# Altium project Driver_BaseSTM32G4.PrjPcb
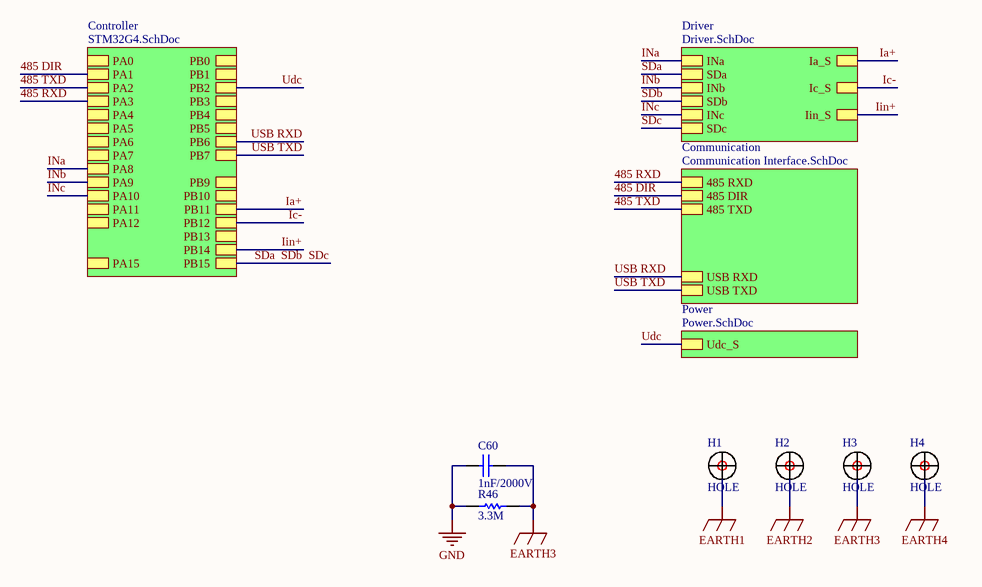
[diagram p0: Main.SchDoc]
5 sheets, 174 parts. Net scope: hierarchical (ports join the sheet entries above them; power ports are global).
Board file: Driver.PcbDoc
Sheets:
  Main.SchDoc
    Controller = STM32G4.SchDoc
    Power = Power.SchDoc
    Driver = Driver.SchDoc
    Communication = Communication Interface.SchDoc

## Sheet Main.SchDoc
size A4

### Parts
C60  1nF/2000V  [C1206]
H1  HOLE  [定位孔 Φ3 1]
H2  HOLE  [定位孔 Φ3 1]
H3  HOLE  [定位孔 Φ3 1]
H4  HOLE  [定位孔 Φ3 1]
R46  3.3M  [R1206]

### Sub-sheets
Communication = Communication Interface.SchDoc: 485 RXD, 485 DIR, 485 TXD, USB RXD, USB TXD
Controller = STM32G4.SchDoc: PA1, PA2, PA3, PA4, PA5, PA6, PA7, PA8, PA9, PA10, PA11, PA12, PA15, PB1, PB2, PB3, PB4, PB5, PB6, PB7, PB9, PB10, PB11, PB12, PB13, PB14, PB15, PA0, PB0
Driver = Driver.SchDoc: INa, SDa, Ia_S, Ic_S, INb, SDb, INc, SDc, Iin_S
Power = Power.SchDoc: Udc_S

### Nets
EARTH1: H1.1
EARTH2: H2.1
EARTH3: C60.2 H3.1 R46.1
EARTH4: H4.1
GND: C60.1 R46.2
485 DIR: sheet Controller/PA1, sheet Communication/485 DIR
485 RXD: sheet Controller/PA3, sheet Communication/485 RXD
485 TXD: sheet Controller/PA2, sheet Communication/485 TXD
Ia+: sheet Controller/PB11, sheet Driver/Ia_S
Ic-: sheet Controller/PB12, sheet Driver/Ic_S
Iin+: sheet Controller/PB14, sheet Driver/Iin_S
INa: sheet Controller/PA8, sheet Driver/INa
INb: sheet Controller/PA9, sheet Driver/INb
INc: sheet Controller/PA10, sheet Driver/INc
SDa: sheet Controller/PB15, sheet Driver/SDa, sheet Driver/SDb, sheet Driver/SDc  [also labelled SDb, SDc]
Udc: sheet Controller/PB2, sheet Power/Udc_S
USB RXD: sheet Controller/PB6, sheet Communication/USB RXD
USB TXD: sheet Controller/PB7, sheet Communication/USB TXD

### Library data of the parts
C60 = Cap
R46 = RES

## Sheet STM32G4.SchDoc
size A4
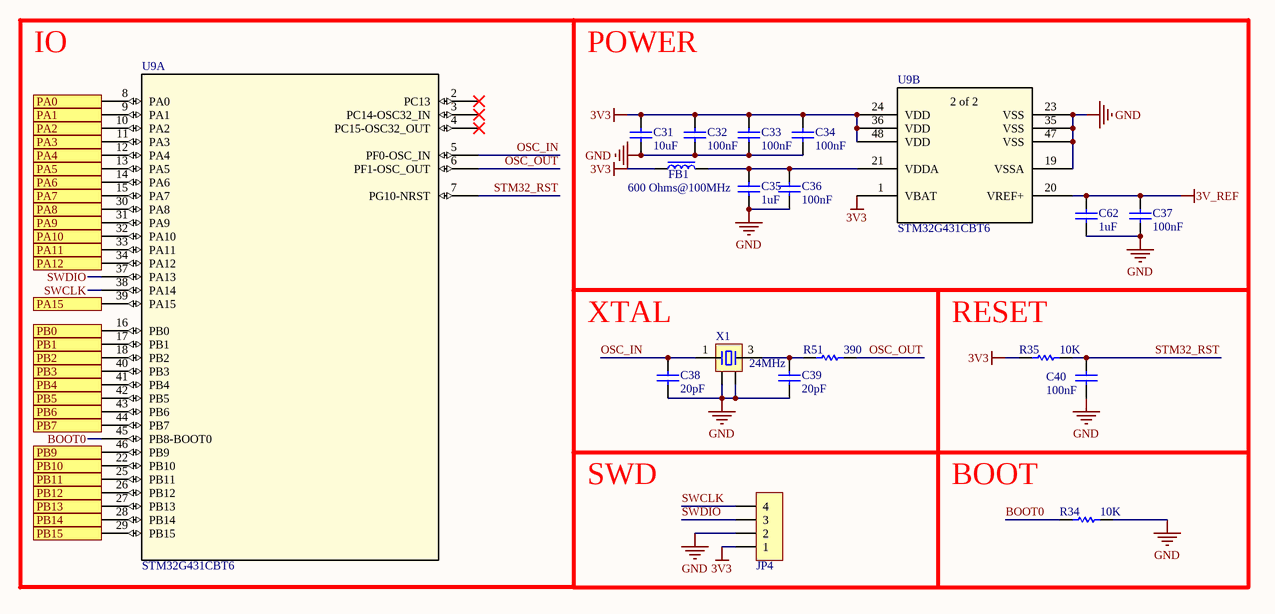
[diagram p1: STM32G4.SchDoc]

### Parts
C31  10uF  [C0805]
C32  100nF  [C0402]
C33  100nF  [C0402]
C34  100nF  [C0402]
C35  1uF  [C0603]
C36  100nF  [C0402]
C37  100nF  [C0402]
C38  20pF  [C0402]
C39  20pF  [C0402]
C40  100nF  [C0402]
C62  1uF  [C0603]
FB1  600 Ohms@100MHz  [FB 0402]
JP4  HDR-1X4  [XH2.54-4P_H]  (value not drawn)
R34  10K  [R0402]
R35  10K  [R0402]
R51  390  [R0402]
U9  STM32G431CBT6  [LQFP48 7X7_L]  (parts A,B of 2)
X1  24MHz  [XTAL-3225]

### Ports
PA0, PA1, PA2, PA3, PA4, PA5, PA6, PA7, PA8, PA9, PA10, PA11, PA12, PA15, PB0, PB1, PB2, PB3, PB4, PB5, PB6, PB7, PB9, PB10, PB11, PB12, PB13, PB14, PB15

### Nets
3V3: C31.2 C32.2 C33.2 C34.2 FB1.1 JP4.1 R35.1 U9.1(VBAT) U9.24(VDD) U9.36(VDD) U9.48(VDD)
3V_REF: C37.1 C62.1 U9.20(VREF+)
GND: C31.1 C32.1 C33.1 C34.1 C35.2 C36.2 C37.2 C38.1 C39.1 C40.1 C62.2 JP4.2 R34.2 U9.19(VSSA) U9.23(VSS) U9.35(VSS) U9.47(VSS) X1.2 X1.4
485 DIR: U9.9(PA1) ; port PA1
485 RXD: U9.11(PA3) ; port PA3
485 TXD: U9.10(PA2) ; port PA2
BOOT0: R34.1 U9.45(PB8-BOOT0)
Ia+: U9.25(PB11) ; port PB11
Ic-: U9.26(PB12) ; port PB12
Iin+: U9.28(PB14) ; port PB14
INa: U9.30(PA8) ; port PA8
INb: U9.31(PA9) ; port PA9
INc: U9.32(PA10) ; port PA10
OSC_IN: C38.2 U9.5(PF0-OSC_IN) X1.1
OSC_OUT: R51.2 U9.6(PF1-OSC_OUT)
SDa: U9.29(PB15) ; port PB15
STM32_RST: C40.2 R35.2 U9.7(PG10-NRST)
SWCLK: JP4.4 U9.38(PA14)
SWDIO: JP4.3 U9.37(PA13)
Udc: U9.18(PB2) ; port PB2
USB RXD: U9.43(PB6) ; port PB6
USB TXD: U9.44(PB7) ; port PB7
NetC35_1: C35.1 C36.1 FB1.2 U9.21(VDDA)
NetC39_2: C39.2 R51.1 X1.3
NetU9_8: U9.8(PA0) ; port PA0
NetU9_12: U9.12(PA4) ; port PA4
NetU9_13: U9.13(PA5) ; port PA5
NetU9_14: U9.14(PA6) ; port PA6
NetU9_15: U9.15(PA7) ; port PA7
NetU9_16: U9.16(PB0) ; port PB0
NetU9_17: U9.17(PB1) ; port PB1
NetU9_22: U9.22(PB10) ; port PB10
NetU9_27: U9.27(PB13) ; port PB13
NetU9_33: U9.33(PA11) ; port PA11
NetU9_34: U9.34(PA12) ; port PA12
NetU9_39: U9.39(PA15) ; port PA15
NetU9_40: U9.40(PB3) ; port PB3
NetU9_41: U9.41(PB4) ; port PB4
NetU9_42: U9.42(PB5) ; port PB5
NetU9_46: U9.46(PB9) ; port PB9

Not connected (* = marked no-connect by the designer): U9 2(PC13)* 3(PC14-OSC32_IN)* 4(PC15-OSC32_OUT)*

### Notes on the sheet
- IO
- POWER
- (near C38) XTAL
- (near R35) RESET
- SWD
- BOOT
- (in symbol STM32G431CBT6, part B) 2 of 2

### Library data of the parts
C31-C40 C62 = Cap
FB1 = FB: 磁珠
JP4 = Header 4P: 4P接插件; 版权归属: 源创客; BOM名称: 4P接插件; 学习资源: www.ooocke.com
R34 R35 R51 = RES
U9 = STM32G431CBT6: No Description Available; Mfr_Name: STMicroelectronics; Copyright: Copyright (C) 2022 Ultra Librarian. All rights reserved.; Manufacturer_Part_Number: STM32G431CBT6; RefDes: RefDes; Type: DEV
X1 = XTAL-4: 4脚晶振; 版权归属: 源创客; BOM名称: 4脚晶振; 学习资源: www.ooocke.com

## Sheet Power.SchDoc
size A4
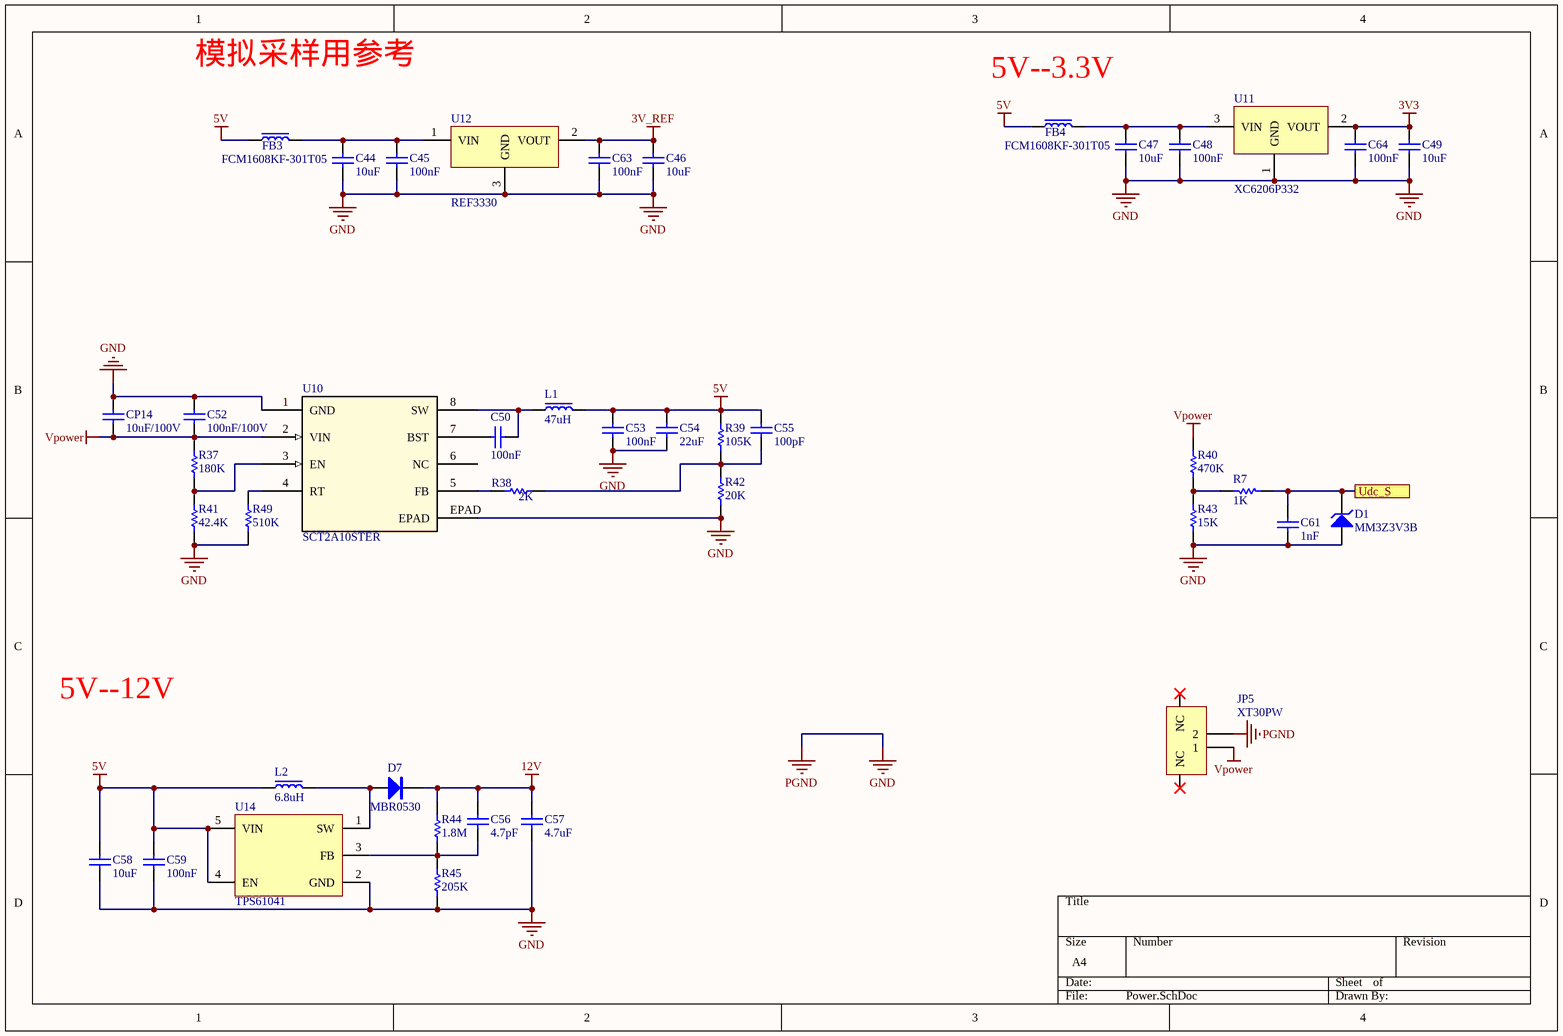
[diagram p2: Power.SchDoc]

### Parts
C44  10uF  [C0603]
C45  100nF  [C0603]
C46  10uF  [C0603]
C47  10uF  [C0603]
C48  100nF  [C0603]
C49  10uF  [C0603]
C50  100nF  [C0603]
C52  100nF/100V  [C0603]
C53  100nF  [C0603]
C54  22uF  [C0805]
C55  100pF  [C0603]
C56  4.7pF  [C0603]
C57  4.7uF  [C0805]
C58  10uF  [C0805]
C59  100nF  [C0603]
C61  1nF  [C0402]
C63  100nF  [C0603]
C64  100nF  [C0603]
CP14  10uF/100V  [C1206]
D1  MM3Z3V3B  [SOD-323]
D7  MBR0530  [SOD-123]
FB3  FCM1608KF-301T05  [FB 0402]
FB4  FCM1608KF-301T05  [FB 0402]
JP5  XT30PW  [XT30PW-M]
L1  47uH  [L 0630]
L2  6.8uH  [L 0530]
R7  1K  [R0402]
R37  180K  [R0603]
R38  2K  [R0603]
R39  105K  [R0603]
R40  470K  [R0402]
R41  42.4K  [R0603]
R42  20K  [R0603]
R43  15K  [R0402]
R44  1.8M  [R0603]
R45  205K  [R0603]
R49  510K  [R0603]
U10  SCT2A10STER  [DDA8_3P1X2P41-L]
U11  XC6206P332  [SOT23-3L]
U12  REF3330  [SOT23-3L]
U14  TPS61041  [SOT23-5L]

### Ports
Udc_S

### Nets
3V3: C49.2 C64.2 U11.2(VOUT)
3V_REF: C46.2 C63.2 U12.2(VOUT)
5V: C53.2 C54.1 C55.1 C58.2 C59.2 FB3.1 FB4.1 L1.2 L2.1 R39.2 U14.4(EN) U14.5(VIN)
12V: C56.2 C57.2 D7.K R44.1
GND: C44.1 C45.1 C46.1 C47.1 C48.1 C49.1 C52.1 C53.1 C54.2 C57.1 C58.1 C59.1 C61.2 C63.1 C64.1 CP14.1 D1.A JP5.2 R41.1 R42.1 R43.1 R45.2 R49.1 U10.1(GND) U10.EPAD U11.1(GND) U12.3(GND) U14.2(GND)  [also labelled PGND]
Vpower: C52.2 CP14.2 JP5.1 R37.2 R40.2 U10.2(VIN)
Udc: C61.1 D1.K R7.2 ; port Udc_S
NetC44_2: C44.2 C45.2 FB3.2 U12.1(VIN)
NetC47_2: C47.2 C48.2 FB4.2 U11.3(VIN)
NetC50_1: C50.1 U10.7(BST)
NetC50_2: C50.2 L1.1 U10.8(SW)
NetC55_2: C55.2 R38.1 R39.1 R42.2
NetC56_1: C56.1 R44.2 R45.1 U14.3(FB)
NetD7_A: D7.A L2.2 U14.1(SW)
NetR7_1: R7.1 R40.1 R43.2
NetR37_1: R37.1 R41.2 U10.3(EN)
NetR38_2: R38.2 U10.5(FB)
NetR49_2: R49.2 U10.4(RT)

Not connected (* = marked no-connect by the designer): JP5 3(NC)* 4(NC)*; U10 6(NC)

### Notes on the sheet
- 模拟采样用参考
- 5V--3.3V
- 5V--12V

### Library data of the parts
C44-C50 C52-C59 C61 C63 C64 CP14 = Cap
D1 = MM3Z3V3B: 3.14V~3.47V / 300mW
D7 = MBR0530: 30V 0.5A
FB3 FB4 = FB: 磁珠
L1 L2 = L-CDRH: 功率屏蔽电感
R7 R37-R45 R49 = RES
U10 = SCT2A10STER: No Description Available; Manufacturer_Part_Number: SCT2A10STER
U11 = XC6206: VIN < 6V
U12 = REF33XX: TI 电压基准
U14 = TPS6104x: Boost DC-DC

## Sheet Driver.SchDoc
size A4
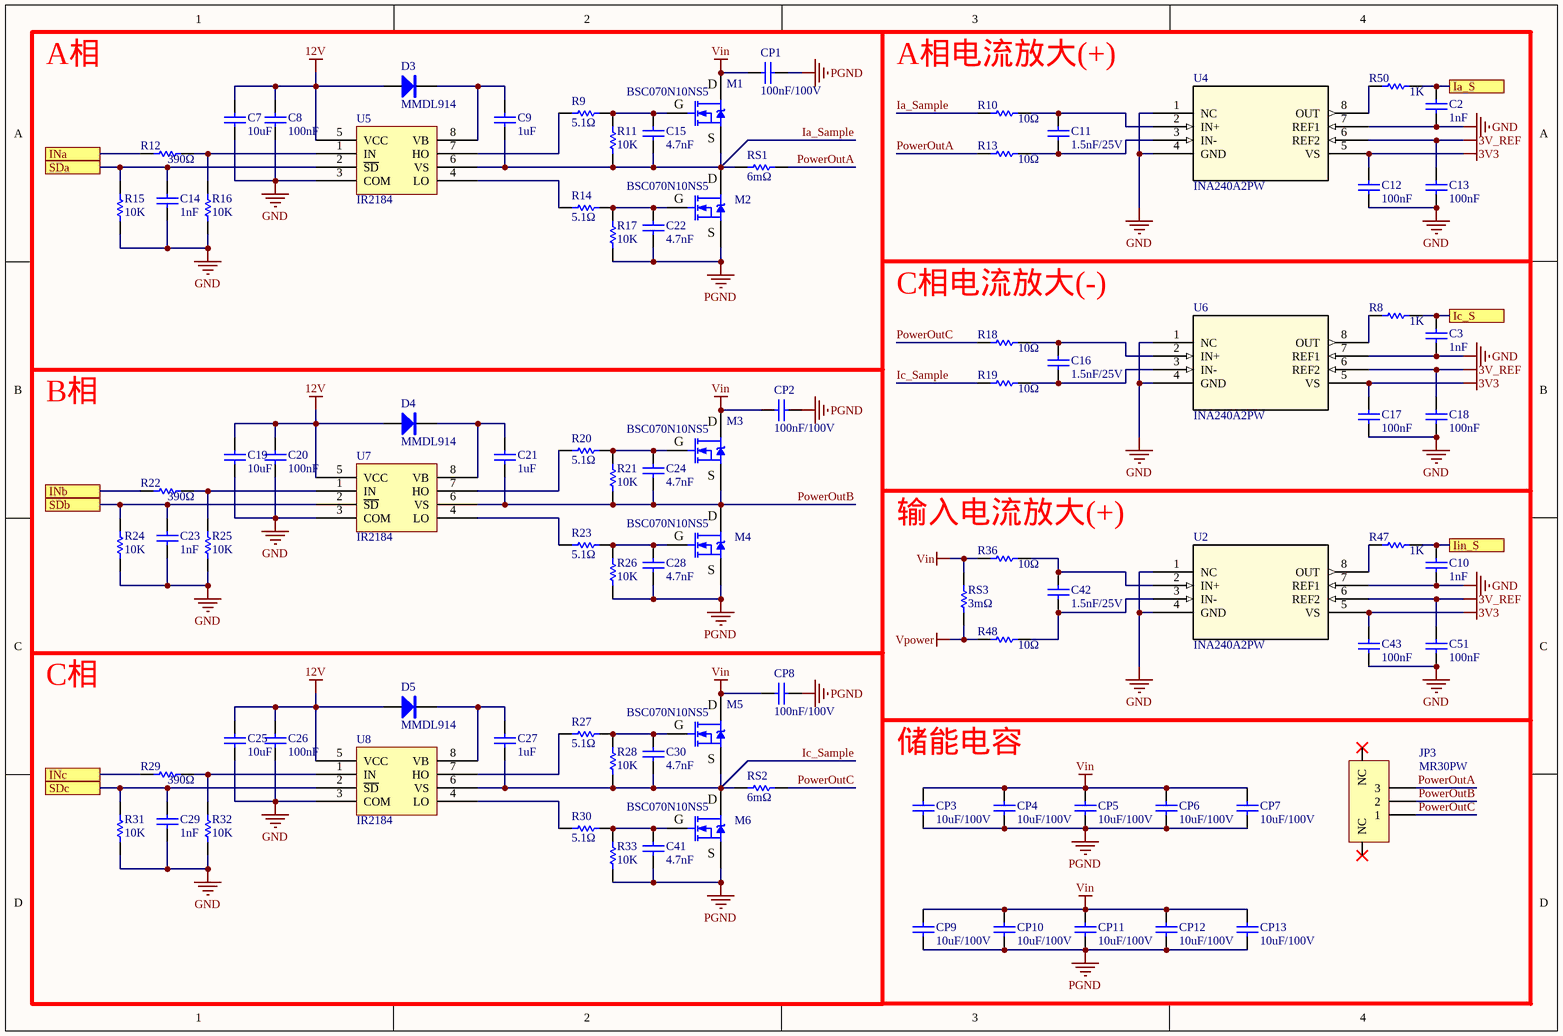
[diagram p3: Driver.SchDoc]

### Parts
C2  1nF  [C0402]
C3  1nF  [C0402]
C7  10uF  [C0805]
C8  100nF  [C0603]
C9  1uF  [C0805]
C10  1nF  [C0402]
C11  1.5nF/25V  [C0402]
C12  100nF  [C0402]
C13  100nF  [C0402]
C14  1nF  [C0603]
C15  4.7nF  [C0603]
C16  1.5nF/25V  [C0402]
C17  100nF  [C0402]
C18  100nF  [C0402]
C19  10uF  [C0805]
C20  100nF  [C0603]
C21  1uF  [C0805]
C22  4.7nF  [C0603]
C23  1nF  [C0603]
C24  4.7nF  [C0603]
C25  10uF  [C0805]
C26  100nF  [C0603]
C27  1uF  [C0805]
C28  4.7nF  [C0603]
C29  1nF  [C0603]
C30  4.7nF  [C0603]
C41  4.7nF  [C0603]
C42  1.5nF/25V  [C0402]
C43  100nF  [C0402]
C51  100nF  [C0402]
CP1  100nF/100V  [C0603]
CP2  100nF/100V  [C0603]
CP3  10uF/100V  [C1206]
CP4  10uF/100V  [C1206]
CP5  10uF/100V  [C1206]
CP6  10uF/100V  [C1206]
CP7  10uF/100V  [C1206]
CP8  100nF/100V  [C0603]
CP9  10uF/100V  [C1206]
CP10  10uF/100V  [C1206]
CP11  10uF/100V  [C1206]
CP12  10uF/100V  [C1206]
CP13  10uF/100V  [C1206]
D3  MMDL914  [SOD-323]
D4  MMDL914  [SOD-323]
D5  MMDL914  [SOD-323]
JP3  MR30PW  [MR30PW-FB]
M1  BSC070N10NS5  [TDSON-8]
M2  BSC070N10NS5  [TDSON-8]
M3  BSC070N10NS5  [TDSON-8]
M4  BSC070N10NS5  [TDSON-8]
M5  BSC070N10NS5  [TDSON-8]
M6  BSC070N10NS5  [TDSON-8]
R8  1K  [R0402]
R9  5.1Ω  [R0603]
R10  10Ω  [R0402]
R11  10K  [R0603]
R12  390Ω  [R0603]
R13  10Ω  [R0402]
R14  5.1Ω  [R0603]
R15  10K  [R0603]
R16  10K  [R0603]
R17  10K  [R0603]
R18  10Ω  [R0402]
R19  10Ω  [R0402]
R20  5.1Ω  [R0603]
R21  10K  [R0603]
R22  390Ω  [R0603]
R23  5.1Ω  [R0603]
R24  10K  [R0603]
R25  10K  [R0603]
R26  10K  [R0603]
R27  5.1Ω  [R0603]
R28  10K  [R0603]
R29  390Ω  [R0603]
R30  5.1Ω  [R0603]
R31  10K  [R0603]
R32  10K  [R0603]
R33  10K  [R0603]
R36  10Ω  [R0402]
R47  1K  [R0402]
R48  10Ω  [R0402]
R50  1K  [R0402]
RS1  6mΩ  [R1206]
RS2  6mΩ  [R1206]
RS3  3mΩ  [R1206]
U2  INA240A2PW  [TSSOP8_L 3*4.4mm]
U4  INA240A2PW  [TSSOP8_L 3*4.4mm]
U5  IR2184  [SOP8_L]
U6  INA240A2PW  [TSSOP8_L 3*4.4mm]
U7  IR2184  [SOP8_L]
U8  IR2184  [SOP8_L]

### Ports
Ia_S, Ic_S, Iin_S, INa, INb, INc, SDa, SDb, SDc

### Nets
3V3: C12.2 C17.2 C43.2 U2.5(VS) U4.5(VS) U6.5(VS)
3V_REF: C13.2 C18.2 C51.2 U2.6(REF2) U4.6(REF2) U6.6(REF2)
12V: C7.1 C8.1 C19.1 C20.1 C25.1 C26.1 D3.A D4.A D5.A U5.5(VCC) U7.5(VCC) U8.5(VCC)
GND: C2.2 C3.2 C7.2 C8.2 C10.2 C12.1 C13.1 C14.2 C17.1 C18.1 C19.2 C20.2 C22.2 C23.2 C25.2 C26.2 C28.2 C29.2 C41.2 C43.1 C51.1 CP1.1 CP2.1 CP3.1 CP4.1 CP5.1 CP6.1 CP7.1 CP8.1 CP9.1 CP10.1 CP11.1 CP12.1 CP13.1 M2.S M4.S M6.S R15.2 R16.2 R17.1 R24.2 R25.2 R26.1 R31.2 R32.2 R33.1 U2.1(NC) U2.4(GND) U2.7(REF1) U4.1(NC) U4.4(GND) U4.7(REF1) U5.3(COM) U6.1(NC) U6.4(GND) U6.7(REF1) U7.3(COM) U8.3(COM)  [also labelled PGND]
Vin: CP1.2 CP2.2 CP3.2 CP4.2 CP5.2 CP6.2 CP7.2 CP8.2 CP9.2 CP10.2 CP11.2 CP12.2 CP13.2 M1.D M3.D M5.D R36.2 RS3.1
Vpower: R48.2 RS3.2
Ia+: C2.1 R50.1 ; port Ia_S
Ia_Sample: C9.2 C15.2 M1.S M2.D R10.2 R11.1 RS1.2 U5.6(VS)
Ic-: C3.1 R8.1 ; port Ic_S
Ic_Sample: C27.2 C30.2 M5.S M6.D R19.2 R28.1 RS2.2 U8.6(VS)
Iin+: C10.1 R47.1 ; port Iin_S
INa: R12.2 ; port INa
INb: R22.2 ; port INb
INc: R29.2 ; port INc
PowerOutA: JP3.3 R13.2 RS1.1
PowerOutB: C21.2 C24.2 JP3.2 M3.S M4.D R21.1 U7.6(VS)
PowerOutC: JP3.1 R18.2 RS2.1
SDa: C14.1 C23.1 C29.1 R15.1 R24.1 R31.1 U5.2(~{SD}) U7.2(~{SD}) U8.2(~{SD}) ; port SDa, port SDc, port SDb
NetC9_1: C9.1 D3.K U5.8(VB)
NetC11_1: C11.1 R13.1 U4.3(IN-)
NetC11_2: C11.2 R10.1 U4.2(IN+)
NetC15_1: C15.1 M1.G R9.1 R11.2
NetC16_1: C16.1 R19.1 U6.3(IN-)
NetC16_2: C16.2 R18.1 U6.2(IN+)
NetC21_1: C21.1 D4.K U7.8(VB)
NetC22_1: C22.1 M2.G R14.1 R17.2
NetC24_1: C24.1 M3.G R20.1 R21.2
NetC27_1: C27.1 D5.K U8.8(VB)
NetC28_1: C28.1 M4.G R23.1 R26.2
NetC30_1: C30.1 M5.G R27.1 R28.2
NetC41_1: C41.1 M6.G R30.1 R33.2
NetC42_1: C42.1 R48.1 U2.3(IN-)
NetC42_2: C42.2 R36.1 U2.2(IN+)
NetR8_2: R8.2 U6.8(OUT)
NetR9_2: R9.2 U5.7(HO)
NetR12_1: R12.1 R16.1 U5.1(IN)
NetR14_2: R14.2 U5.4(LO)
NetR20_2: R20.2 U7.7(HO)
NetR22_1: R22.1 R25.1 U7.1(IN)
NetR23_2: R23.2 U7.4(LO)
NetR27_2: R27.2 U8.7(HO)
NetR29_1: R29.1 R32.1 U8.1(IN)
NetR30_2: R30.2 U8.4(LO)
NetR47_2: R47.2 U2.8(OUT)
NetR50_2: R50.2 U4.8(OUT)

Not connected (* = marked no-connect by the designer): JP3 4(NC)* 5(NC)*

### Notes on the sheet
- A相
- A相电流放大(+)
- C相电流放大(-)
- B相
- (near R36) 输入电流放大(+)
- C相
- 储能电容

### Library data of the parts
C2 C3 C7-C30 C41-C43 C51 CP1-CP13 = Cap
D3-D5 = MMDL914: 100V 0.2A开关管
M1-M6 = BSC070N10NS5: N沟场效应管
R8-R33 R36 R47 R48 R50 RS1-RS3 = RES
U2 U4 U6 = INA240: No Description Available; Mfr_Name: Texas Instruments; Manufacturer_Part_Number: INA240A1PW; Copyright: Copyright (C) 2022 Ultra Librarian. All rights reserved.; RefDes: RefDes; Type: DEV
U5 U7 U8 = IR2184: 半桥驱动

## Sheet Communication Interface.SchDoc
size A4
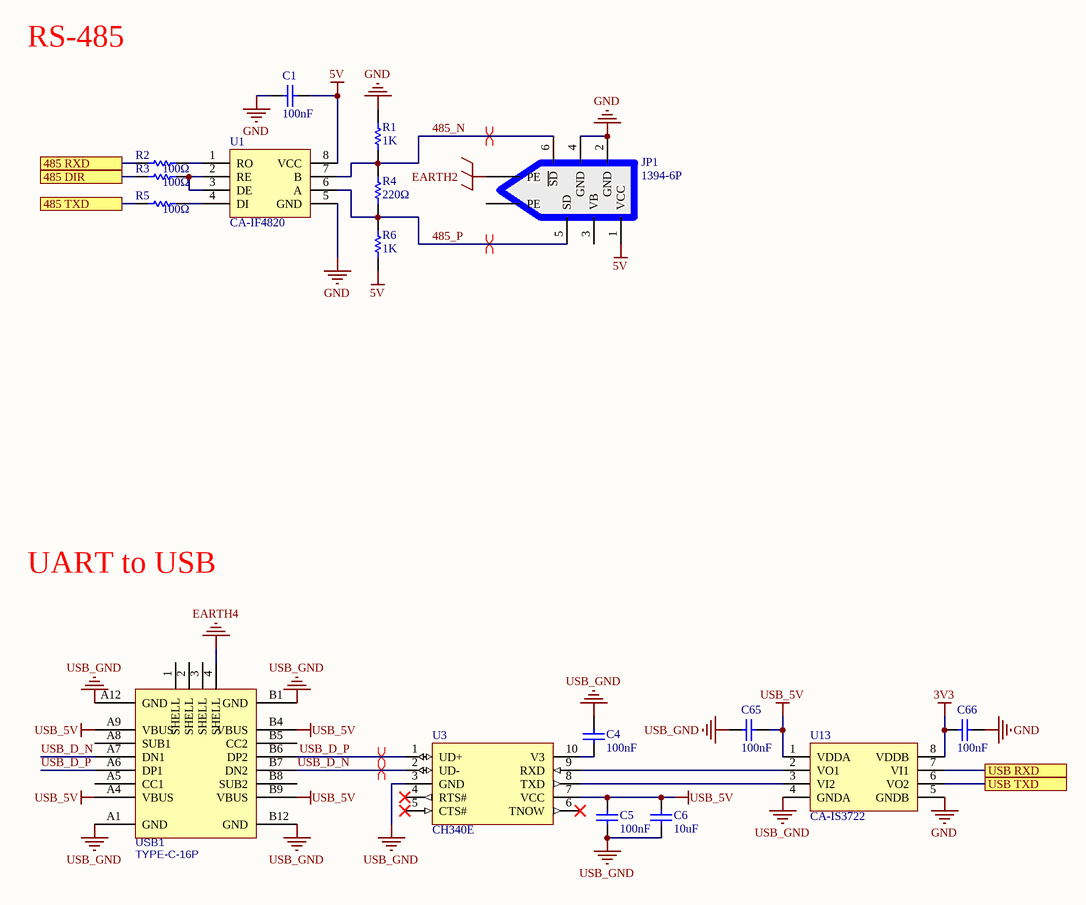
[diagram p4: Communication Interface.SchDoc]

### Parts
C1  100nF  [C0603]
C4  100nF  [C0603]
C5  100nF  [C0603]
C6  10uF  [C0603]
C65  100nF  [C0603]
C66  100nF  [C0603]
JP1  1394-6P  [1394-6P]
R1  1K  [R0603]
R2  100Ω  [R0603]
R3  100Ω  [R0603]
R4  220Ω  [R0603]
R5  100Ω  [R0603]
R6  1K  [R0603]
U1  CA-IF4820  [SOP8_N]
U3  CH340E  [MSOP10]
U13  CA-IS3722  [SOIC8_L W=3.9mm]
USB1  TYPE-C-16P  [USB-C_16P]

### Ports
485 DIR, 485 RXD, 485 TXD, USB RXD, USB TXD

### Nets
3V3: C66.1 U13.8(VDDB)
5V: C1.2 JP1.1(VCC) R6.1 U1.8(VCC)
EARTH2: JP1.7(PE)
EARTH4: USB1.4(SHELL)
GND: C1.1 C66.2 JP1.2(GND) JP1.4(GND) R1.2 U1.5(GND) U13.5(GNDB)
USB_5V: C5.1 C6.1 C65.2 U3.7(VCC) U13.1(VDDA) USB1.A4(VBUS) USB1.A9(VBUS) USB1.B4(VBUS) USB1.B9(VBUS)
USB_GND: C4.2 C5.2 C6.2 C65.1 U3.3(GND) U13.4(GNDA) USB1.A1(GND) USB1.A12(GND) USB1.B1(GND) USB1.B12(GND)
485 DIR: R3.1 ; port 485 DIR
485 RXD: R2.1 ; port 485 RXD
485 TXD: R5.1 ; port 485 TXD
485_N: JP1.6(~{SD}) R1.1 R4.2 U1.7(B)
485_P: JP1.5(SD) R4.1 R6.2 U1.6(A)
USB RXD: U13.7(VI1) ; port USB RXD
USB TXD: U13.6(VO2) ; port USB TXD
USB_D_N: U3.2(UD-) USB1.A7(DN1) USB1.B7(DN2)
USB_D_P: U3.1(UD+) USB1.A6(DP1) USB1.B6(DP2)
NetC4_1: C4.1 U3.10(V3)
NetR2_2: R2.2 U1.1(RO)
NetR3_2: R3.2 U1.2(RE) U1.3(DE)
NetR5_2: R5.2 U1.4(DI)
NetU3_8: U3.8(TXD) U13.3(VI2)
NetU3_9: U3.9(RXD) U13.2(VO1)

Not connected (* = marked no-connect by the designer): JP1 3(VB) 8(PE); U3 4(RTS#)* 5(CTS#)* 6(TNOW)*; USB1 1(SHELL) 2(SHELL) 3(SHELL) A5(CC1) A8(SUB1) B5(CC2) B8(SUB2)

### Layout directives
differential pair: 485_N, 485_P, USB_D_N, USB_D_P

### Notes on the sheet
- RS-485
- UART to USB

### Library data of the parts
C1 C6 = Cap
C4 C5 C65 C66 = Cap_100nF
JP1 = 1394-6P: IEEE 1394 FireWire接口
R1-R6 = RES
U1 = CA-IF4820: 485总线芯片
U3 = CH340E: USB to TTL Serial / UART
U13 = CA-IS3722: 隔离芯片
USB1 = USB-C-16P: BOM_Manufacturer: Shenzhen Kinghelm Elec; BOM_Manufacturer Part: KH-TYPE-C-16P; Contributor: LCSC; BOM_Supplier: LCSC; BOM_Supplier Part: C709357; BOM_JLCPCB Part Class: Extended Part; spicePre: U; spiceSymbolName: KH-TYPE-C-16P

## Nets that join several sheets
3V3: STM32G4 (11 pins), Power (C49.2 C64.2 U11.2), Driver (6 pins), Communication Interface (C66.1 U13.8)
3V_REF: STM32G4 (C37.1 C62.1 U9.20), Power (C46.2 C63.2 U12.2), Driver (6 pins)
5V: Power (12 pins), Communication Interface (C1.2 JP1.1 R6.1 U1.8)
12V: Power (C56.2 C57.2 D7.K R44.1), Driver (12 pins)
EARTH2: Main (H2.1), Communication Interface (JP1.7)
EARTH4: Main (H4.1), Communication Interface (USB1.4)
GND: Main (C60.1 R46.2), STM32G4 (19 pins), Power (28 pins), Driver (58 pins), Communication Interface (7 pins)
Vpower: Power (6 pins), Driver (R48.2 RS3.2)
485 DIR: STM32G4 (U9.9), Communication Interface (R3.1)
485 RXD: STM32G4 (U9.11), Communication Interface (R2.1)
485 TXD: STM32G4 (U9.10), Communication Interface (R5.1)
Ia+: STM32G4 (U9.25), Driver (C2.1 R50.1)
Ic-: STM32G4 (U9.26), Driver (C3.1 R8.1)
Iin+: STM32G4 (U9.28), Driver (C10.1 R47.1)
INa: STM32G4 (U9.30), Driver (R12.2)
INb: STM32G4 (U9.31), Driver (R22.2)
INc: STM32G4 (U9.32), Driver (R29.2)
SDa: STM32G4 (U9.29), Driver (9 pins)
Udc: STM32G4 (U9.18), Power (C61.1 D1.K R7.2)
USB RXD: STM32G4 (U9.43), Communication Interface (U13.7)
USB TXD: STM32G4 (U9.44), Communication Interface (U13.6)